# Altium schematic sheet 08_DDR2.SchDoc
size OrCAD B
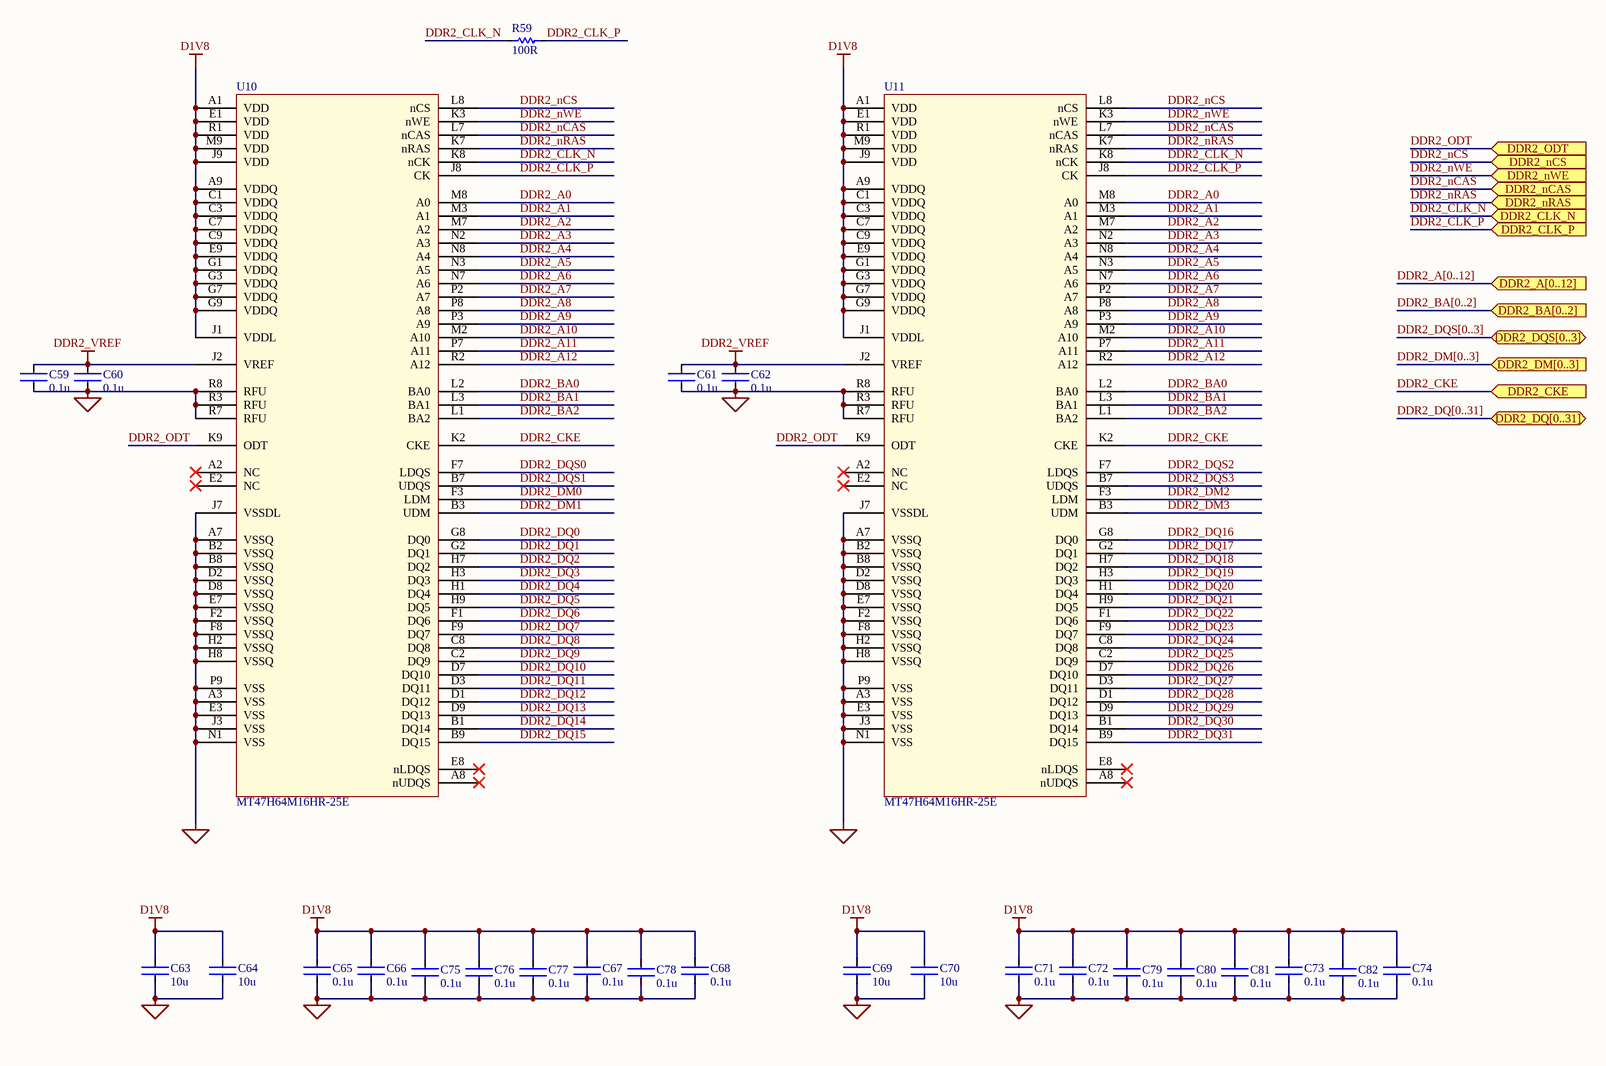
[diagram p0: 08_DDR2.SchDoc]

## Parts
C59  0.1u  [C0402]
C60  0.1u  [C0402]
C61  0.1u  [C0402]
C62  0.1u  [C0402]
C63  10u  [CAPC1608X09N_C0603]
C64  10u  [CAPC1608X09N_C0603]
C65  0.1u  [C0402]
C66  0.1u  [C0402]
C67  0.1u  [C0402]
C68  0.1u  [C0402]
C69  10u  [CAPC1608X09N_C0603]
C70  10u  [CAPC1608X09N_C0603]
C71  0.1u  [C0402]
C72  0.1u  [C0402]
C73  0.1u  [C0402]
C74  0.1u  [C0402]
C75  0.1u  [C0402]
C76  0.1u  [C0402]
C77  0.1u  [C0402]
C78  0.1u  [C0402]
C79  0.1u  [C0402]
C80  0.1u  [C0402]
C81  0.1u  [C0402]
C82  0.1u  [C0402]
R59  100R  [R0402]
U10  MT47H64M16HR-25E  [FBGA84_MT47H64M16HR-25E]
U11  MT47H64M16HR-25E  [FBGA84_MT47H64M16HR-25E]

## Ports
DDR2_A[0..12] (in), DDR2_BA[0..2] (in), DDR2_CKE (in), DDR2_CLK_N (in), DDR2_CLK_P (in), DDR2_DM[0..3] (in), DDR2_DQ[0..31] (bidir), DDR2_DQS[0..3] (bidir), DDR2_nCAS (in), DDR2_nCS (in), DDR2_nRAS (in), DDR2_nWE (in), DDR2_ODT (in)

## Nets
D1V8: C63.1 C64.1 C65.1 C66.1 C67.1 C68.1 C69.1 C70.1 C71.1 C72.1 C73.1 C74.1 C75.1 C76.1 C77.1 C78.1 C79.1 C80.1 C81.1 C82.1 U10.A1(VDD) U10.A9(VDDQ) U10.C1(VDDQ) U10.C3(VDDQ) U10.C7(VDDQ) U10.C9(VDDQ) U10.E1(VDD) U10.E9(VDDQ) U10.G1(VDDQ) U10.G3(VDDQ) U10.G7(VDDQ) U10.G9(VDDQ) U10.J1(VDDL) U10.J9(VDD) U10.M9(VDD) U10.R1(VDD) U11.A1(VDD) U11.A9(VDDQ) U11.C1(VDDQ) U11.C3(VDDQ) U11.C7(VDDQ) U11.C9(VDDQ) U11.E1(VDD) U11.E9(VDDQ) U11.G1(VDDQ) U11.G3(VDDQ) U11.G7(VDDQ) U11.G9(VDDQ) U11.J1(VDDL) U11.J9(VDD) U11.M9(VDD) U11.R1(VDD)
DDR2_VREF: C59.1 C60.1 C61.1 C62.1 U10.J2(VREF) U11.J2(VREF)
GND: C59.2 C61.2 C62.2 C63.2 C64.2 C65.2 C66.2 C67.2 C68.2 C69.2 C70.2 C71.2 C72.2 C73.2 C74.2 C75.2 C76.2 C77.2 C78.2 C79.2 C80.2 C81.2 C82.2 U10.A3(VSS) U10.A7(VSSQ) U10.B2(VSSQ) U10.B8(VSSQ) U10.D2(VSSQ) U10.D8(VSSQ) U10.E3(VSS) U10.E7(VSSQ) U10.F2(VSSQ) U10.F8(VSSQ) U10.H2(VSSQ) U10.H8(VSSQ) U10.J3(VSS) U10.J7(VSSDL) U10.N1(VSS) U10.P9(VSS) U10.R3(RFU) U10.R7(RFU) U10.R8(RFU) U11.A3(VSS) U11.A7(VSSQ) U11.B2(VSSQ) U11.B8(VSSQ) U11.D2(VSSQ) U11.D8(VSSQ) U11.E3(VSS) U11.E7(VSSQ) U11.F2(VSSQ) U11.F8(VSSQ) U11.H2(VSSQ) U11.H8(VSSQ) U11.J3(VSS) U11.J7(VSSDL) U11.N1(VSS) U11.P9(VSS) U11.R3(RFU) U11.R7(RFU) U11.R8(RFU)
DDR2_A0: U10.M8(A0) U11.M8(A0)
DDR2_A1: U10.M3(A1) U11.M3(A1)
DDR2_A2: U10.M7(A2) U11.M7(A2)
DDR2_A3: U10.N2(A3) U11.N2(A3)
DDR2_A4: U10.N8(A4) U11.N8(A4)
DDR2_A5: U10.N3(A5) U11.N3(A5)
DDR2_A6: U10.N7(A6) U11.N7(A6)
DDR2_A7: U10.P2(A7) U11.P2(A7)
DDR2_A8: U10.P8(A8) U11.P8(A8)
DDR2_A9: U10.P3(A9) U11.P3(A9)
DDR2_A10: U10.M2(A10) U11.M2(A10)
DDR2_A11: U10.P7(A11) U11.P7(A11)
DDR2_A12: U10.R2(A12) U11.R2(A12)
DDR2_BA0: U10.L2(BA0) U11.L2(BA0)
DDR2_BA1: U10.L3(BA1) U11.L3(BA1)
DDR2_BA2: U10.L1(BA2) U11.L1(BA2)
DDR2_CKE: U10.K2(CKE) U11.K2(CKE) ; port DDR2_CKE
DDR2_CLK_N: R59.1 U10.K8(nCK) U11.K8(nCK) ; port DDR2_CLK_N
DDR2_CLK_P: R59.2 U10.J8(CK) U11.J8(CK) ; port DDR2_CLK_P
DDR2_DM0: U10.F3(LDM)
DDR2_DM1: U10.B3(UDM)
DDR2_DM2: U11.F3(LDM)
DDR2_DM3: U11.B3(UDM)
DDR2_DQ0: U10.G8(DQ0)
DDR2_DQ1: U10.G2(DQ1)
DDR2_DQ2: U10.H7(DQ2)
DDR2_DQ3: U10.H3(DQ3)
DDR2_DQ4: U10.H1(DQ4)
DDR2_DQ5: U10.H9(DQ5)
DDR2_DQ6: U10.F1(DQ6)
DDR2_DQ7: U10.F9(DQ7)
DDR2_DQ8: U10.C8(DQ8)
DDR2_DQ9: U10.C2(DQ9)
DDR2_DQ10: U10.D7(DQ10)
DDR2_DQ11: U10.D3(DQ11)
DDR2_DQ12: U10.D1(DQ12)
DDR2_DQ13: U10.D9(DQ13)
DDR2_DQ14: U10.B1(DQ14)
DDR2_DQ15: U10.B9(DQ15)
DDR2_DQ16: U11.G8(DQ0)
DDR2_DQ17: U11.G2(DQ1)
DDR2_DQ18: U11.H7(DQ2)
DDR2_DQ19: U11.H3(DQ3)
DDR2_DQ20: U11.H1(DQ4)
DDR2_DQ21: U11.H9(DQ5)
DDR2_DQ22: U11.F1(DQ6)
DDR2_DQ23: U11.F9(DQ7)
DDR2_DQ24: U11.C8(DQ8)
DDR2_DQ25: U11.C2(DQ9)
DDR2_DQ26: U11.D7(DQ10)
DDR2_DQ27: U11.D3(DQ11)
DDR2_DQ28: U11.D1(DQ12)
DDR2_DQ29: U11.D9(DQ13)
DDR2_DQ30: U11.B1(DQ14)
DDR2_DQ31: U11.B9(DQ15)
DDR2_DQS0: U10.F7(LDQS)
DDR2_DQS1: U10.B7(UDQS)
DDR2_DQS2: U11.F7(LDQS)
DDR2_DQS3: U11.B7(UDQS)
DDR2_nCAS: U10.L7(nCAS) U11.L7(nCAS) ; port DDR2_nCAS
DDR2_nCS: U10.L8(nCS) U11.L8(nCS) ; port DDR2_nCS
DDR2_nRAS: U10.K7(nRAS) U11.K7(nRAS) ; port DDR2_nRAS
DDR2_nWE: U10.K3(nWE) U11.K3(nWE) ; port DDR2_nWE
DDR2_ODT: U10.K9(ODT) U11.K9(ODT) ; port DDR2_ODT

Not connected (* = marked no-connect by the designer): C60 2(1); U10 A2(NC)* A8(nUDQS)* E2(NC)* E8(nLDQS)*; U11 A2(NC)* A8(nUDQS)* E2(NC)* E8(nLDQS)*

## Buses and harness runs
bus DDR2_A[0..12] = port DDR2_A[0..12]
bus DDR2_BA[0..2] = port DDR2_BA[0..2]
bus DDR2_DM[0..3] = port DDR2_DM[0..3]
bus DDR2_DQ[0..31] = port DDR2_DQ[0..31]
bus DDR2_DQS[0..3] = port DDR2_DQS[0..3]

## Library data of the parts
C59-C62 C65-C68 C71-C82 = CAP011: CAP,Ceramic,X7R,10%,16V,0.1uF,0402; Manufacturer1: *; Manufacturer2: *; PartNumberManufacturer1: *; UnitPrice: *; Value: 0.1u
C63 C64 C69 C70 = CAP113: CAP,Ceramic,X7R,10%,6.3V,10uF,0603; Manufacturer1: *; Manufacturer2: *; PartNumberManufacturer1: *; UnitPrice: *; Value: 10u
R59 = RES019: RES,100R,1%,1/16W,0402; Manufacturer1: *; PartNumberManufacturer2: *; Manufacturer2: *; PartNumberManufacturer1: *; Value: 100R; UnitPrice: *
U10 U11 = MT47H64M16HR-25E: IC,DDR2 SDRAM,64Mx16,FBGA84; Manufacturer1: Micron; PartNumberManufacturer1: MT47H64M16HR-25E; Manufacturer2: *; PartNumberManufacturer2: *; UnitPrice: *